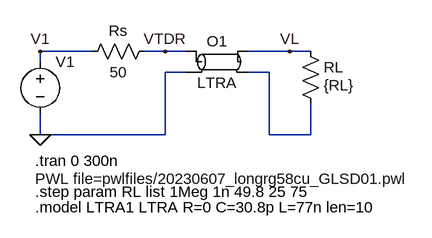
[diagram p0: schematic ltra_test.asc]
ltra_test.asc, the LTspice schematic file:
Version 4
SHEET 1 1272 680
WIRE 16 144 -64 144
WIRE 128 144 96 144
WIRE 160 144 128 144
WIRE 320 144 256 144
WIRE 352 144 320 144
WIRE -64 160 -64 144
WIRE 160 176 128 176
WIRE 288 176 256 176
WIRE -64 272 -64 240
WIRE 128 272 128 176
WIRE 128 272 -64 272
WIRE 288 272 288 176
WIRE 352 272 352 224
WIRE 352 272 288 272
FLAG -64 272 0
FLAG 320 144 VL
FLAG -64 144 V1
FLAG 128 144 VTDR
SYMBOL res 112 128 R90
WINDOW 0 0 56 VBottom 2
WINDOW 3 32 56 VTop 2
SYMATTR InstName Rs
SYMATTR Value 50
SYMBOL voltage -64 144 R0
WINDOW 123 0 0 Left 0
WINDOW 39 0 0 Left 0
WINDOW 3 -8 196 Left 2
SYMATTR Value PWL file=pwlfiles/20230607_longrg58cu_GLSD01.pwl
SYMATTR InstName V1
SYMBOL res 336 128 R0
WINDOW 3 36 68 Left 2
SYMATTR Value {RL}
SYMATTR InstName RL
SYMBOL ltline 208 160 R0
SYMATTR InstName O1
SYMATTR SpiceModel LTRA1
TEXT -72 312 Left 2 !.tran 0 300n
TEXT -72 384 Left 2 !.model LTRA1 LTRA R=0 C=30.8p L=77n len=10
TEXT -72 360 Left 2 !.step param RL list 1Meg 1n 49.8 25 75

The netlist it stands for:
* ltra_test.asc
Rs VTDR V1 50
V1 V1 0 PWL file=pwlfiles/20230607_longrg58cu_GLSD01.pwl
RL VL N001 {RL}
O1 VTDR 0 VL N001 LTRA1 LTRA
.tran 0 300n
.model LTRA1 LTRA R=0 C=30.8p L=77n len=10
.step param RL list 1Meg 1n 49.8 25 75
.backanno
.end